# Altium project ZUMO-ROBOT.PrjPcb
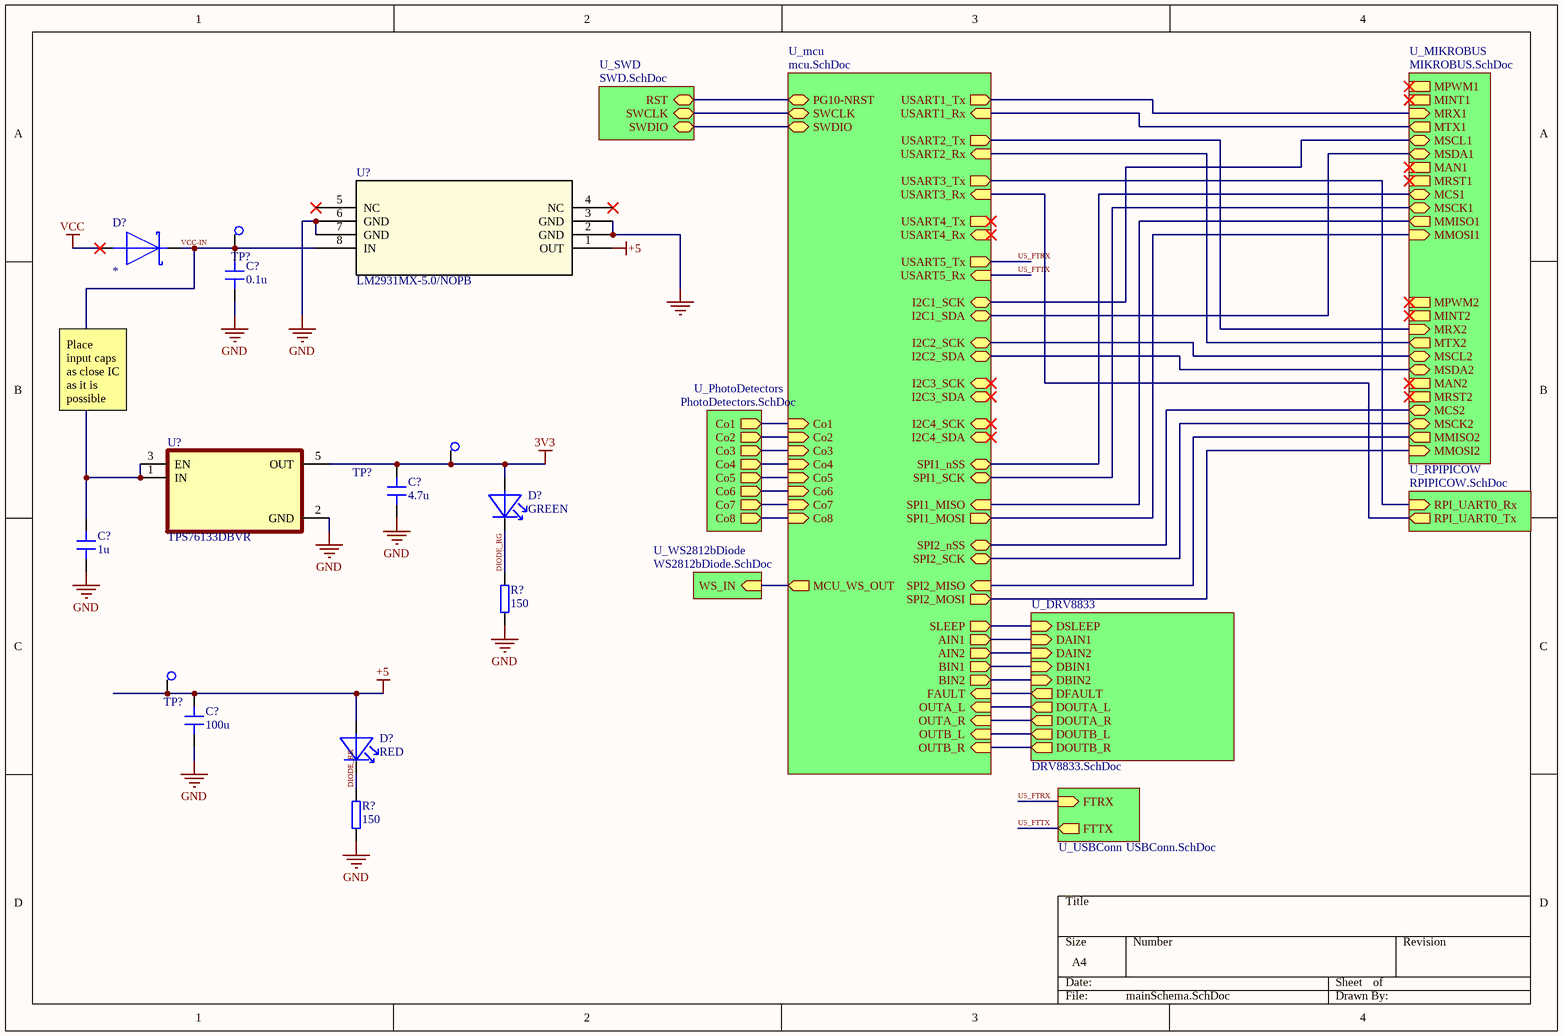
[diagram p0: mainSchema.SchDoc]
9 sheets, 118 parts. Net scope: hierarchical (ports join the sheet entries above them; power ports are global).
Sheets:
  mainSchema.SchDoc
    U_mcu = mcu.SchDoc
    U_SWD = SWD.SchDoc
    U_MIKROBUS = MIKROBUS.SchDoc
    U_PhotoDetectors = PhotoDetectors.SchDoc
    U_RPIPICOW = RPIPICOW.SchDoc
    U_DRV8833 = DRV8833.SchDoc
    U_WS2812bDiode = WS2812bDiode.SchDoc
    U_USBConn = USBConn.SchDoc

## Sheet mainSchema.SchDoc
size A4; SheetNumber: 1; SheetTotal: 9

### Parts
(Parts that share a designator on the sheet are numbered #1, #2 ... from top to bottom, then left to right.)
C?#1  0.1u
C?#2  4.7u
C?#3  1u
C?#4  100u
D?#1  *
D?#2  GREEN
D?#3  RED
R?#1  150
R?#2  150
TP?#1  *  [TestPoint]  (value not drawn)
TP?#2  *  [TestPoint]  (value not drawn)
TP?#3  *  [TestPoint]  (value not drawn)
U?#1  LM2931MX-5.0/NOPB  [M08A_TEX]
U?#2  TPS76133DBVR  [SOT95P280X145-5N]

### Sub-sheets
U_DRV8833 = DRV8833.SchDoc: DOUTB_R (out), DOUTA_R (out), DOUTB_L (out), DOUTA_L (out), DAIN1 (in), DBIN1 (in), DAIN2 (in), DBIN2 (in), DSLEEP (in), DFAULT (out)
U_mcu = mcu.SchDoc: PG10-NRST (bidir), SWCLK (bidir), SWDIO (bidir), USART1_Tx (out), USART1_Rx (in), USART2_Tx (out), USART2_Rx (in), USART3_Tx (out), USART3_Rx (in), USART4_Tx (out), USART4_Rx (in), USART5_Tx (out), USART5_Rx (in), I2C1_SCK (bidir), I2C1_SDA (bidir), I2C2_SCK (bidir), I2C2_SDA (bidir), I2C3_SCK (bidir), I2C3_SDA (bidir), I2C4_SCK (bidir), I2C4_SDA (bidir), SPI1_nSS (bidir), SPI1_SCK (bidir), SPI1_MISO (in), SPI1_MOSI (out), SPI2_nSS (bidir), SPI2_SCK (bidir), SPI2_MISO (in), SPI2_MOSI (out), Co1 (in), Co2 (in), Co3 (in), Co4 (in), Co5 (in), Co6 (in), Co7 (in), Co8 (in), AIN1 (out), AIN2 (out), BIN1 (out), BIN2 (out), FAULT (in), OUTA_L (in), OUTA_R (in), OUTB_L (in), OUTB_R (in), SLEEP (out), MCU_WS_OUT (out)
U_MIKROBUS = MIKROBUS.SchDoc: MPWM1, MINT1, MRX1 (in), MTX1 (out), MSCL1 (bidir), MSDA1 (bidir), MAN1, MRST1, MCS1 (bidir), MSCK1 (bidir), MMISO1 (out), MMOSI1 (in), MPWM2, MINT2, MRX2 (in), MTX2 (out), MSCL2 (bidir), MSDA2 (bidir), MAN2, MRST2, MCS2 (bidir), MSCK2 (bidir), MMISO2 (out), MMOSI2 (in)
U_PhotoDetectors = PhotoDetectors.SchDoc: Co1 (out), Co2 (out), Co3 (out), Co4 (out), Co5 (out), Co6 (out), Co7 (out), Co8 (out)
U_RPIPICOW = RPIPICOW.SchDoc: RPI_UART0_Tx (out), RPI_UART0_Rx (in)
U_SWD = SWD.SchDoc: SWDIO (bidir), SWCLK (bidir), RST (bidir)
U_USBConn = USBConn.SchDoc: FTRX (in), FTTX (out)
U_WS2812bDiode = WS2812bDiode.SchDoc: WS_IN (in)

### Nets
3V3: C?#2.2 D?#2.1 TP?#2.1 U?#2.5(OUT)
+5: C?#4.2 D?#3.1 TP?#3.1 U?#1.1(OUT)
GND: C?#1.1 C?#2.1 C?#3.1 C?#4.1 R?#1.1 R?#2.1 U?#1.6(GND) U?#1.7(GND) U?#2.2(GND)
NetU?#1_2: U?#1.2(GND) U?#1.3(GND)
VCC: D?#1.1
AIN1: sheet U_mcu/AIN1, sheet U_DRV8833/DAIN1
AIN2: sheet U_mcu/AIN2, sheet U_DRV8833/DAIN2
BIN1: sheet U_mcu/BIN1, sheet U_DRV8833/DBIN1
BIN2: sheet U_mcu/BIN2, sheet U_DRV8833/DBIN2
Co1: sheet U_mcu/Co1, sheet U_PhotoDetectors/Co1
Co2: sheet U_mcu/Co2, sheet U_PhotoDetectors/Co2
Co3: sheet U_mcu/Co3, sheet U_PhotoDetectors/Co3
Co4: sheet U_mcu/Co4, sheet U_PhotoDetectors/Co4
Co5: sheet U_mcu/Co5, sheet U_PhotoDetectors/Co5
Co6: sheet U_mcu/Co6, sheet U_PhotoDetectors/Co6
Co7: sheet U_mcu/Co7, sheet U_PhotoDetectors/Co7
Co8: sheet U_mcu/Co8, sheet U_PhotoDetectors/Co8
DIODE_RG: D?#2.2 R?#1.2  [project net DIODE_RG_1]
DIODE_RR: D?#3.2 R?#2.2  [project net DIODE_RR_1]
DOUTA_L: sheet U_mcu/OUTA_R, sheet U_DRV8833/DOUTA_R
DOUTB_L: sheet U_mcu/OUTB_R, sheet U_DRV8833/DOUTB_R
DOUTB_R: sheet U_mcu/OUTB_L, sheet U_DRV8833/DOUTB_L
DRV_FAULT: sheet U_mcu/FAULT, sheet U_DRV8833/DFAULT
DRV_SLEEP: sheet U_mcu/SLEEP, sheet U_DRV8833/DSLEEP
I2C1_SCK: sheet U_mcu/I2C1_SCK, sheet U_MIKROBUS/MSCL1
I2C1_SDA: sheet U_mcu/I2C1_SDA, sheet U_MIKROBUS/MSDA1
I2C2_SCK: sheet U_mcu/I2C2_SCK, sheet U_MIKROBUS/MSCL2
I2C2_SDA: sheet U_mcu/I2C2_SDA, sheet U_MIKROBUS/MSDA2
MCS1: sheet U_mcu/SPI1_nSS, sheet U_MIKROBUS/MCS1
MCS2: sheet U_mcu/SPI2_nSS, sheet U_MIKROBUS/MCS2
MCU_WS_OUT: sheet U_mcu/MCU_WS_OUT, sheet U_WS2812bDiode/WS_IN
MMISO1: sheet U_mcu/SPI1_MISO, sheet U_MIKROBUS/MMISO1
MMISO2: sheet U_mcu/SPI2_MISO, sheet U_MIKROBUS/MMISO2
MMOSI1: sheet U_mcu/SPI1_MOSI, sheet U_MIKROBUS/MMOSI1
MMOSI2: sheet U_mcu/SPI2_MOSI, sheet U_MIKROBUS/MMOSI2
MRX1: sheet U_mcu/USART1_Tx, sheet U_MIKROBUS/MRX1
MRX2: sheet U_mcu/USART2_Tx, sheet U_MIKROBUS/MRX2
MSCK1: sheet U_mcu/SPI1_SCK, sheet U_MIKROBUS/MSCK1
MSCK2: sheet U_mcu/SPI2_SCK, sheet U_MIKROBUS/MSCK2
MTX1: sheet U_mcu/USART1_Rx, sheet U_MIKROBUS/MTX1
MTX2: sheet U_mcu/USART2_Rx, sheet U_MIKROBUS/MTX2
OUTA_L: sheet U_mcu/OUTA_L, sheet U_DRV8833/DOUTA_L
PG10-NRST: sheet U_mcu/PG10-NRST, sheet U_SWD/RST
RPI_UART0_Rx: sheet U_mcu/USART3_Tx, sheet U_RPIPICOW/RPI_UART0_Rx
RPI_UART0_Tx: sheet U_mcu/USART3_Rx, sheet U_RPIPICOW/RPI_UART0_Tx
SWCLK: sheet U_mcu/SWCLK, sheet U_SWD/SWCLK
SWDIO: sheet U_mcu/SWDIO, sheet U_SWD/SWDIO
U5_FTRX: sheet U_mcu/USART5_Tx, sheet U_USBConn/FTRX  [project net FTRX]
U5_FTTX: sheet U_mcu/USART5_Rx, sheet U_USBConn/FTTX  [project net FTTX]
VCC-IN: C?#1.2 C?#3.2 D?#1.2 TP?#1.1 U?#1.8(IN) U?#2.1(IN) U?#2.3(EN)  [project net VCC-IN_1]

Not connected (* = marked no-connect by the designer): U?#1 4(NC)* 5(NC)*

### Notes on the sheet
- Place input caps as close IC as it is possible

### Library data of the parts
C?#1-C?#4 = Capacitor: Value: *; HelpURL: *; MPN: *; Supplier: *; SupplierPartNumber: *
D?#1 = Schotky: Value: *; HelpURL: *; MPN: *; Supplier: *; SupplierPartNumber: *
D?#2 D?#3 = LED: Value: *; HelpURL: *; MPN: *; Supplier: *; SupplierPartNumber: *
R?#1 R?#2 = Resistor: Value: *; HelpURL: *; MPN: *; Supplier: *; SupplierPartNumber: *
TP?#1-TP?#3 = TP: Value: *; HelpURL: *; MPN: *; Supplier: *; SupplierPartNumber: *
U?#1 = LM2931MX-5.0NOPB: No Description Available; Mfr_Name: Texas Instruments; Copyright: Copyright (C) 2023 Ultra Librarian. All rights reserved.; Manufacturer_Part_Number: LM2931MX-5.0/NOPB; RefDes: RefDes; Type: DEV
U?#2 = TPS76133DBVR: 100-mA, 16-V, low-dropout voltage regulator with reverse current protection 5-SOT-23 -40 to 125; MF: Texas Instruments; Price: None; MP: TPS76133DBVR; Mouser-Purchase-URL: https://snapeda.com/shop?store=Mouser&id=582733; SnapEDA_Link: https://www.snapeda.com/parts/TPS76133DBVR/Texas%20Instruments/view-part/582733/?ref=snap; Package: SOT-23-5 Texas Instruments; DigiKey-Purchase-URL: https://snapeda.com/shop?store=DigiKey&id=582733; Availability: Good; Texas_Instruments-Purchase-URL: https://snapeda.com/shop?store=Texas+Instruments&id=582733; Value: *

## Sheet mcu.SchDoc
size A4; SheetNumber: 2; SheetTotal: 8
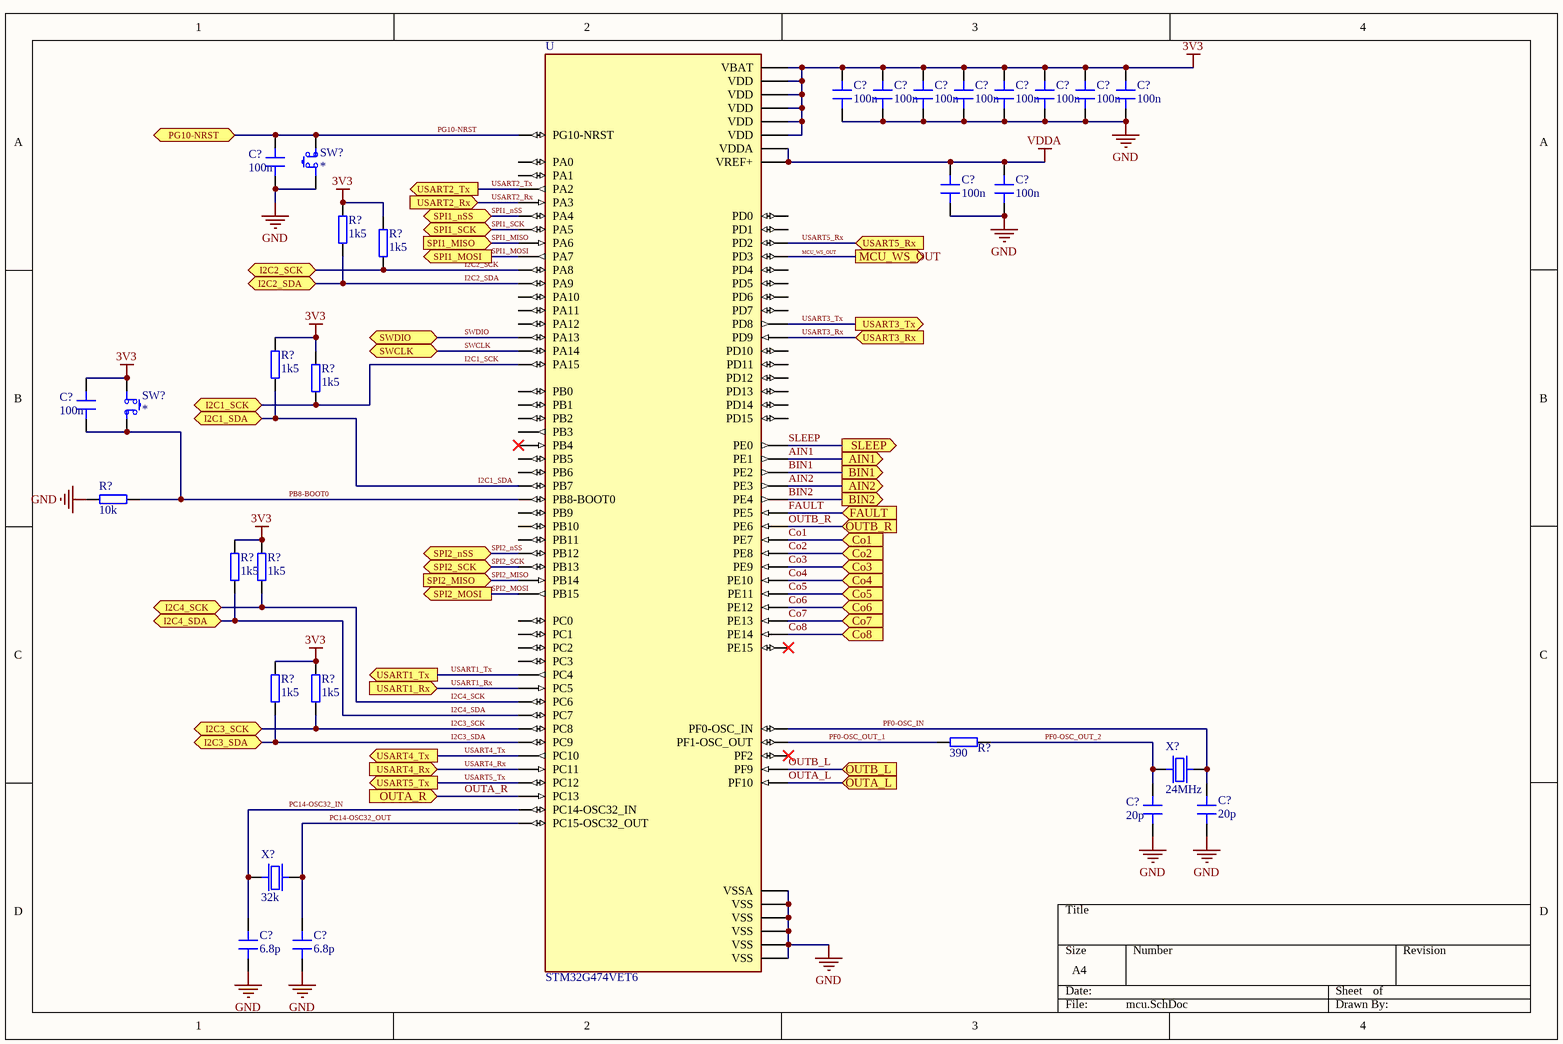
[diagram p1: mcu.SchDoc]

### Parts
(Parts that share a designator on the sheet are numbered #1, #2 ... from top to bottom, then left to right.)
C?#5  100n
C?#6  100n
C?#7  100n
C?#8  100n
C?#9  100n
C?#10  100n
C?#11  100n
C?#12  100n
C?#13  100n
C?#14  100n
C?#15  100n
C?#16  100n
C?#17  20p
C?#18  20p
C?#19  6.8p
C?#20  6.8p
R?#3  1k5
R?#4  1k5
R?#5  1k5
R?#6  1k5
R?#7  10k
R?#8  1k5
R?#9  1k5
R?#10  1k5
R?#11  1k5
R?#12  390
SW?#1  *
SW?#2  *
U  STM32G474VET6  [QFP50P1600X1600X160-100N]
X?#1  24MHz
X?#2  32k

### Ports
AIN1 (out), AIN2 (out), BIN1 (out), BIN2 (out), Co1 (in), Co2 (in), Co3 (in), Co4 (in), Co5 (in), Co6 (in), Co7 (in), Co8 (in), FAULT (in), I2C1_SCK (bidir, see mainSchema[3B]), I2C1_SDA (bidir, see mainSchema[3B]), I2C2_SCK (bidir, see mainSchema[3B]), I2C2_SDA (bidir, see mainSchema[3B]), I2C3_SCK (bidir, see mainSchema[3B]), I2C3_SDA (bidir, see mainSchema[3B]), I2C4_SCK (bidir, see mainSchema[3B]), I2C4_SDA (bidir, see mainSchema[3B]), MCU_WS_OUT (out), OUTA_L (in), OUTA_R (in), OUTB_L (in), OUTB_R (in), PG10-NRST (bidir, see mainSchema[3A]), SLEEP (out), SPI1_MISO (in, see mainSchema[3B]), SPI1_MOSI (out, see mainSchema[3C]), SPI1_nSS (bidir, see mainSchema[3B]), SPI1_SCK (bidir, see mainSchema[3B]), SPI2_MISO (in, see mainSchema[3C]), SPI2_MOSI (out, see mainSchema[3C]), SPI2_nSS (bidir, see mainSchema[3C]), SPI2_SCK (bidir, see mainSchema[3C]), SWCLK (bidir, see mainSchema[3A], SWD[2A]), SWDIO (bidir, see mainSchema[3A], SWD[2A]), USART1_Rx (in, see mainSchema[3A]), USART1_Tx (out, see mainSchema[3A]), USART2_Rx (in, see mainSchema[3A]), USART2_Tx (out, see mainSchema[3A]), USART3_Rx (in, see mainSchema[3A]), USART3_Tx (out, see mainSchema[3A]), USART4_Rx (in, see mainSchema[3A]), USART4_Tx (out, see mainSchema[3A]), USART5_Rx (in, see mainSchema[3B]), USART5_Tx (out, see mainSchema[3B])

### Nets
3V3: C?#5.2 C?#6.2 C?#7.2 C?#8.2 C?#9.2 C?#10.2 C?#11.2 C?#12.2 C?#16.1 R?#3.2 R?#4.2 R?#5.2 R?#6.2 R?#8.2 R?#9.2 R?#10.2 R?#11.2 SW?#2.1 U.6(VBAT) U.24(VDD) U.49(VDD) U.64(VDD) U.75(VDD) U.100(VDD)
GND: C?#5.1 C?#6.1 C?#7.1 C?#8.1 C?#9.1 C?#10.1 C?#11.1 C?#12.1 C?#13.2 C?#14.1 C?#15.1 C?#17.1 C?#18.1 C?#19.1 C?#20.1 R?#7.2 SW?#1.1 U.23(VSS) U.35(VSSA) U.48(VSS) U.63(VSS) U.74(VSS) U.99(VSS)
VDDA: C?#14.2 C?#15.2 U.36(VREF+) U.37(VDDA)
AIN1: U.98(PE1) ; port AIN1
AIN2: U.2(PE3) ; port AIN2
BIN1: U.1(PE2) ; port BIN1
BIN2: U.3(PE4) ; port BIN2
Co1: U.38(PE7) ; port Co1
Co2: U.39(PE8) ; port Co2
Co3: U.40(PE9) ; port Co3
Co4: U.41(PE10) ; port Co4
Co5: U.42(PE11) ; port Co5
Co6: U.43(PE12) ; port Co6
Co7: U.44(PE13) ; port Co7
Co8: U.45(PE14) ; port Co8
FAULT: U.4(PE5) ; port FAULT  [project net DRV_FAULT]
I2C1_SCK: R?#6.1 U.78(PA15) ; port I2C1_SCK
I2C1_SDA: R?#5.1 U.94(PB7) ; port I2C1_SDA
I2C2_SCK: R?#4.1 U.69(PA8) ; port I2C2_SCK
I2C2_SDA: R?#3.1 U.70(PA9) ; port I2C2_SDA
I2C3_SCK: R?#11.1 U.67(PC8) ; port I2C3_SCK
I2C3_SDA: R?#10.1 U.68(PC9) ; port I2C3_SDA
I2C4_SCK: R?#9.1 U.65(PC6) ; port I2C4_SCK
I2C4_SDA: R?#8.1 U.66(PC7) ; port I2C4_SDA
MCU_WS_OUT: U.85(PD3) ; port MCU_WS_OUT
OUTA_L: U.11(PF10) ; port OUTA_L
OUTA_R: U.7(PC13) ; port OUTA_R  [project net DOUTA_L]
OUTB_L: U.10(PF9) ; port OUTB_L  [project net DOUTB_R]
OUTB_R: U.5(PE6) ; port OUTB_R  [project net DOUTB_L]
PB8-BOOT0: C?#16.2 R?#7.1 SW?#2.2 U.95(PB8-BOOT0)  [project net PB8-BOOT0_2]
PC14-OSC32_IN: C?#19.2 U.8(PC14-OSC32_IN) X?#2.1  [project net PC14-OSC32_IN_2]
PC14-OSC32_OUT: C?#20.2 U.9(PC15-OSC32_OUT) X?#2.2  [project net PC14-OSC32_OUT_2]
PF0-OSC_IN: C?#18.2 U.12(PF0-OSC_IN) X?#1.2  [project net PF0-OSC_IN_2]
PF0-OSC_OUT_1: R?#12.1 U.13(PF1-OSC_OUT)  [project net PF0-OSC_OUT_1_2]
PF0-OSC_OUT_2: C?#17.2 R?#12.2 X?#1.1  [project net PF0-OSC_OUT_2_2]
PG10-NRST: C?#13.1 SW?#1.2 U.14(PG10-NRST) ; port PG10-NRST
SLEEP: U.97(PE0) ; port SLEEP  [project net DRV_SLEEP]
SPI1_MISO: U.28(PA6) ; port SPI1_MISO  [project net MMISO1]
SPI1_MOSI: U.29(PA7) ; port SPI1_MOSI  [project net MMOSI1]
SPI1_nSS: U.26(PA4) ; port SPI1_nSS  [project net MCS1]
SPI1_SCK: U.27(PA5) ; port SPI1_SCK  [project net MSCK1]
SPI2_MISO: U.53(PB14) ; port SPI2_MISO  [project net MMISO2]
SPI2_MOSI: U.54(PB15) ; port SPI2_MOSI  [project net MMOSI2]
SPI2_nSS: U.51(PB12) ; port SPI2_nSS  [project net MCS2]
SPI2_SCK: U.52(PB13) ; port SPI2_SCK  [project net MSCK2]
SWCLK: U.77(PA14) ; port SWCLK
SWDIO: U.76(PA13) ; port SWDIO
USART1_Rx: U.31(PC5) ; port USART1_Rx  [project net MTX1]
USART1_Tx: U.30(PC4) ; port USART1_Tx  [project net MRX1]
USART2_Rx: U.25(PA3) ; port USART2_Rx  [project net MTX2]
USART2_Tx: U.22(PA2) ; port USART2_Tx  [project net MRX2]
USART3_Rx: U.56(PD9) ; port USART3_Rx  [project net RPI_UART0_Tx]
USART3_Tx: U.55(PD8) ; port USART3_Tx  [project net RPI_UART0_Rx]
USART4_Rx: U.80(PC11) ; port USART4_Rx
USART4_Tx: U.79(PC10) ; port USART4_Tx
USART5_Rx: U.84(PD2) ; port USART5_Rx  [project net FTTX]
USART5_Tx: U.81(PC12) ; port USART5_Tx  [project net FTRX]

Not connected (* = marked no-connect by the designer): U 15(PC0) 16(PC1) 17(PC2) 18(PC3) 19(PF2)* 20(PA0) 21(PA1) 32(PB0) 33(PB1) 34(PB2) 46(PE15)* 47(PB10) 50(PB11) 57(PD10) 58(PD11) 59(PD12) 60(PD13) 61(PD14) 62(PD15) 71(PA10) 72(PA11) 73(PA12) 82(PD0) 83(PD1) 86(PD4) 87(PD5) 88(PD6) 89(PD7) 90(PB3) 91(PB4)* 92(PB5) 93(PB6) 96(PB9)

### Notes on the sheet
- (near C?#7) 100nF for each VDD pin
- (near R?#7) Main Flash memory is selected as boot area when GND. When 3V3 Embedded SRAM1 isselected as boot area

### Library data of the parts
C?#5-C?#20 = Capacitor: Value: *; HelpURL: *; MPN: *; Supplier: *; SupplierPartNumber: *
R?#3-R?#12 = Resistor: Value: *; HelpURL: *; MPN: *; Supplier: *; SupplierPartNumber: *
SW?#1 SW?#2 = Switch: Value: *; HelpURL: *; MPN: *; Supplier: *; SupplierPartNumber: *
U = STM32G474VET6: ARMÂ® CortexÂ®-M4F STM32G4 Microcontroller IC 32-Bit 170MHz 512KB _512K x 8_ FLASH 100-LQFP _14x14_; MF: STMicroelectronics; MP: STM32G474VET6; Value: *; Package: LQFP-100 STMicroelectronics; Availability: Unavailable; Price: None; SnapEDA_Link: https://www.snapeda.com/parts/STM32G474VET6/STMicroelectronics/view-part/3664237/?ref=snap
X?#1 X?#2 = Crystal: Value: *; HelpURL: *; MPN: *; Supplier: *; SupplierPartNumber: *

## Sheet SWD.SchDoc
size A4; SheetNumber: 4; SheetTotal: 4
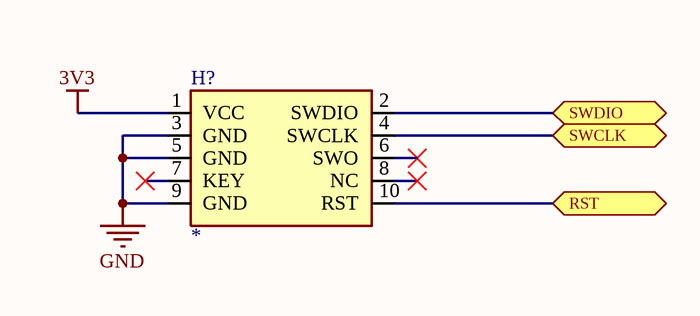
[diagram p2: SWD.SchDoc]

### Parts
(Parts that share a designator on the sheet are numbered #1, #2 ... from top to bottom, then left to right.)
H?#1  *  [SOP10]

### Ports
RST (bidir, see mainSchema[2B]), SWCLK (bidir, see mainSchema[2B], mcu[1B]), SWDIO (bidir, see mainSchema[2B], mcu[1B])

### Nets
3V3: H?#1.1(VCC)
GND: H?#1.3(GND) H?#1.5(GND) H?#1.9(GND)
PG10-NRST: H?#1.10(RST) ; port RST
SWCLK: H?#1.4(SWCLK) ; port SWCLK
SWDIO: H?#1.2(SWDIO) ; port SWDIO

Not connected (* = marked no-connect by the designer): H?#1 6(SWO)* 7(KEY)* 8(NC)*

### Library data of the parts
H?#1 = SWD_HEADER: Value: *; HelpURL: *; MPN: *; Supplier: *; SupplierPartNumber: *

## Sheet MIKROBUS.SchDoc
size A4; SheetNumber: 5; SheetTotal: 6
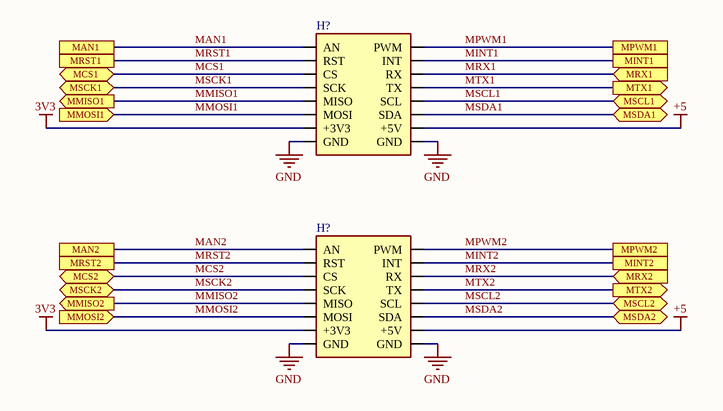
[diagram p3: MIKROBUS.SchDoc]

### Parts
(Parts that share a designator on the sheet are numbered #1, #2 ... from top to bottom, then left to right.)
H?#2  *  (value not drawn)
H?#3  *  (value not drawn)

### Ports
MAN1 (see mainSchema[3A]), MAN2 (see mainSchema[3B]), MCS1 (bidir, see mainSchema[3A]), MCS2 (bidir, see mainSchema[3B]), MINT1 (see mainSchema[3A]), MINT2 (see mainSchema[3B]), MMISO1 (out, see mainSchema[3A]), MMISO2 (out, see mainSchema[3B]), MMOSI1 (in, see mainSchema[3A]), MMOSI2 (in, see mainSchema[3B]), MPWM1 (see mainSchema[3A]), MPWM2 (see mainSchema[3B]), MRST1 (see mainSchema[3A]), MRST2 (see mainSchema[3B]), MRX1 (in, see mainSchema[3A]), MRX2 (in, see mainSchema[3B]), MSCK1 (bidir, see mainSchema[3A]), MSCK2 (bidir, see mainSchema[3B]), MSCL1 (bidir, see mainSchema[3A]), MSCL2 (bidir, see mainSchema[3B]), MSDA1 (bidir, see mainSchema[3A]), MSDA2 (bidir, see mainSchema[3B]), MTX1 (out, see mainSchema[3A]), MTX2 (out, see mainSchema[3B])

### Nets
3V3: H?#2.15(+3V3) H?#3.15(+3V3)
+5: H?#2.2(+5V) H?#3.2(+5V)
GND: H?#2.1(GND) H?#2.16(GND) H?#3.1(GND) H?#3.16(GND)
MAN1: H?#2.9(AN) ; port MAN1
MAN2: H?#3.9(AN) ; port MAN2
MCS1: H?#2.11(CS) ; port MCS1
MCS2: H?#3.11(CS) ; port MCS2
MINT1: H?#2.7(INT) ; port MINT1
MINT2: H?#3.7(INT) ; port MINT2
MMISO1: H?#2.13(MISO) ; port MMISO1
MMISO2: H?#3.13(MISO) ; port MMISO2
MMOSI1: H?#2.14(MOSI) ; port MMOSI1
MMOSI2: H?#3.14(MOSI) ; port MMOSI2
MPWM1: H?#2.8(PWM) ; port MPWM1
MPWM2: H?#3.8(PWM) ; port MPWM2
MRST1: H?#2.10(RST) ; port MRST1
MRST2: H?#3.10(RST) ; port MRST2
MRX1: H?#2.6(RX) ; port MRX1
MRX2: H?#3.6(RX) ; port MRX2
MSCK1: H?#2.12(SCK) ; port MSCK1
MSCK2: H?#3.12(SCK) ; port MSCK2
MSCL1: H?#2.4(SCL) ; port MSCL1  [project net I2C1_SCK]
MSCL2: H?#3.4(SCL) ; port MSCL2  [project net I2C2_SCK]
MSDA1: H?#2.3(SDA) ; port MSDA1  [project net I2C1_SDA]
MSDA2: H?#3.3(SDA) ; port MSDA2  [project net I2C2_SDA]
MTX1: H?#2.5(TX) ; port MTX1
MTX2: H?#3.5(TX) ; port MTX2

### Library data of the parts
H?#2 H?#3 = MIKROBUS: Value: *; HelpURL: *; MPN: *; Supplier: *; SupplierPartNumber: *

## Sheet PhotoDetectors.SchDoc
size A4; SheetNumber: 6; SheetTotal: 7
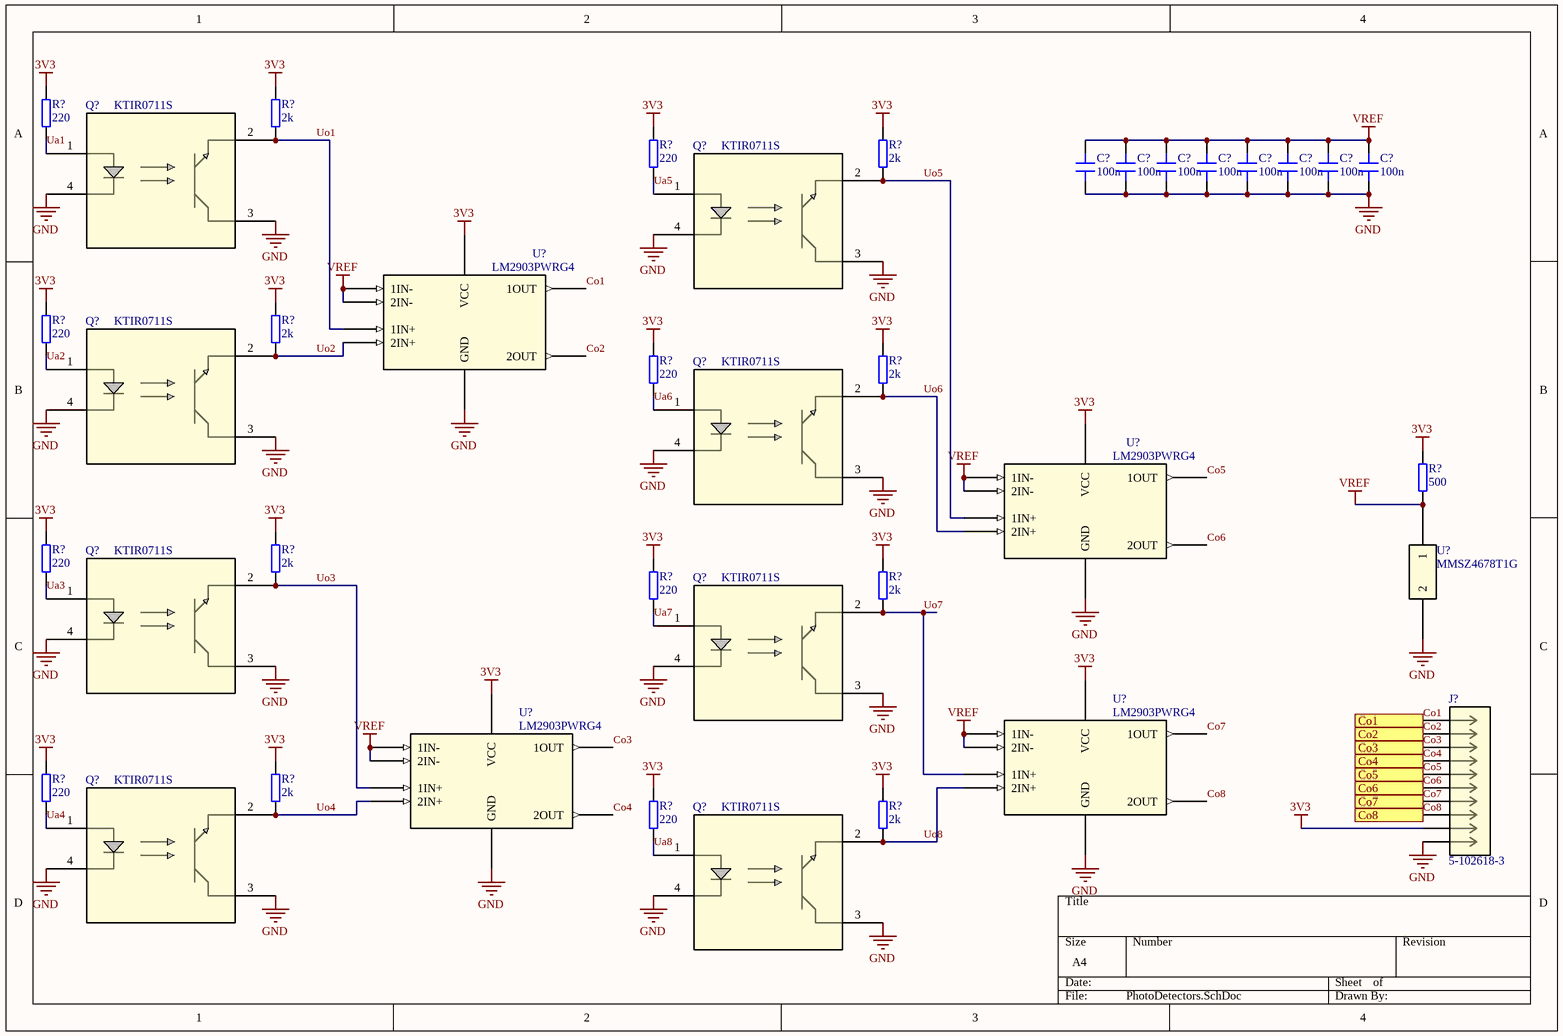
[diagram p4: PhotoDetectors.SchDoc]

### Parts
(Parts that share a designator on the sheet are numbered #1, #2 ... from top to bottom, then left to right.)
C?#21  100n
C?#22  100n
C?#23  100n
C?#24  100n
C?#25  100n
C?#26  100n
C?#27  100n
C?#28  100n
J?#1  5-102618-3  [CONN_102618-3_TEC]
Q?#1  KTIR0711S  [KTIR0711S_KNB]
Q?#2  KTIR0711S  [KTIR0711S_KNB]
Q?#3  KTIR0711S  [KTIR0711S_KNB]
Q?#4  KTIR0711S  [KTIR0711S_KNB]
Q?#5  KTIR0711S  [KTIR0711S_KNB]
Q?#6  KTIR0711S  [KTIR0711S_KNB]
Q?#7  KTIR0711S  [KTIR0711S_KNB]
Q?#8  KTIR0711S  [KTIR0711S_KNB]
R?#13  220
R?#14  2k
R?#15  220
R?#16  2k
R?#17  220
R?#18  2k
R?#19  220
R?#20  2k
R?#21  500
R?#22  220
R?#23  2k
R?#24  220
R?#25  2k
R?#26  220
R?#27  2k
R?#28  220
R?#29  2k
U?#3  LM2903PWRG4  [PW8]
U?#4  MMSZ4678T1G  [SOD_8T1G_ONS]
U?#5  LM2903PWRG4  [PW8]
U?#6  LM2903PWRG4  [PW8]
U?#7  LM2903PWRG4  [PW8]

### Ports
Co1 (out), Co2 (out), Co3 (out), Co4 (out), Co5 (out), Co6 (out), Co7 (out), Co8 (out)

### Nets
3V3: J?#1.9 R?#13.2 R?#14.2 R?#15.2 R?#16.2 R?#17.2 R?#18.2 R?#19.2 R?#20.2 R?#21.2 R?#22.2 R?#23.2 R?#24.2 R?#25.2 R?#26.2 R?#27.2 R?#28.2 R?#29.2 U?#3.8(VCC) U?#5.8(VCC) U?#6.8(VCC) U?#7.8(VCC)
GND: C?#21.1 C?#22.1 C?#23.1 C?#24.1 C?#25.1 C?#26.1 C?#27.1 C?#28.1 J?#1.10 Q?#1.3 Q?#1.4 Q?#2.3 Q?#2.4 Q?#3.3 Q?#3.4 Q?#4.3 Q?#4.4 Q?#5.3 Q?#5.4 Q?#6.3 Q?#6.4 Q?#7.3 Q?#7.4 Q?#8.3 Q?#8.4 U?#3.4(GND) U?#4.2 U?#5.4(GND) U?#6.4(GND) U?#7.4(GND)
VREF: C?#21.2 C?#22.2 C?#23.2 C?#24.2 C?#25.2 C?#26.2 C?#27.2 C?#28.2 R?#21.1 U?#3.2(1IN-) U?#3.6(2IN-) U?#4.1 U?#5.2(1IN-) U?#5.6(2IN-) U?#6.2(1IN-) U?#6.6(2IN-) U?#7.2(1IN-) U?#7.6(2IN-)
Co1: J?#1.1 U?#3.1(1OUT) ; port Co1
Co2: J?#1.2 U?#3.7(2OUT) ; port Co2
Co3: J?#1.3 U?#7.1(1OUT) ; port Co3
Co4: J?#1.4 U?#7.7(2OUT) ; port Co4
Co5: J?#1.5 U?#5.1(1OUT) ; port Co5
Co6: J?#1.6 U?#5.7(2OUT) ; port Co6
Co7: J?#1.7 U?#6.1(1OUT) ; port Co7
Co8: J?#1.8 U?#6.7(2OUT) ; port Co8
Ua1: Q?#1.1 R?#13.1  [project net Ua1_6]
Ua2: Q?#3.1 R?#17.1  [project net Ua2_6]
Ua3: Q?#5.1 R?#22.1  [project net Ua3_6]
Ua4: Q?#7.1 R?#26.1  [project net Ua4_6]
Ua5: Q?#2.1 R?#15.1  [project net Ua5_6]
Ua6: Q?#4.1 R?#19.1  [project net Ua6_6]
Ua7: Q?#6.1 R?#24.1  [project net Ua7_6]
Ua8: Q?#8.1 R?#28.1  [project net Ua8_6]
Uo1: Q?#1.2 R?#14.1 U?#3.3(1IN+)  [project net Uo1_6]
Uo2: Q?#3.2 R?#18.1 U?#3.5(2IN+)  [project net Uo2_6]
Uo3: Q?#5.2 R?#23.1 U?#7.3(1IN+)  [project net Uo3_6]
Uo4: Q?#7.2 R?#27.1 U?#7.5(2IN+)  [project net Uo4_6]
Uo5: Q?#2.2 R?#16.1 U?#5.3(1IN+)  [project net Uo5_6]
Uo6: Q?#4.2 R?#20.1 U?#5.5(2IN+)  [project net Uo6_6]
Uo7: Q?#6.2 R?#25.1 U?#6.3(1IN+)  [project net Uo7_6]
Uo8: Q?#8.2 R?#29.1 U?#6.5(2IN+)  [project net Uo8_6]

### Library data of the parts
C?#21-C?#28 = Capacitor: Value: *; HelpURL: *; MPN: *; Supplier: *; SupplierPartNumber: *
J?#1 = 5-102618-3: No Description Available; Mfr_Name: TE Connectivity; Type: DEV; Copyright: Copyright (C) 2023 Ultra Librarian. All rights reserved.; Manufacturer_Part_Number: 5-102618-3; RefDes: RefDes
Q?#1-Q?#8 = KTIR0711S: No Description Available; Mfr_Name: Kingbright; Type: DEV; Copyright: Copyright (C) 2023 Ultra Librarian. All rights reserved.; Manufacturer_Part_Number: KTIR0711S; RefDes: RefDes
R?#13-R?#29 = Resistor: Value: *; HelpURL: *; MPN: *; Supplier: *; SupplierPartNumber: *
U?#3 U?#5-U?#7 = LM2903PWRG4: No Description Available; Mfr_Name: Texas Instruments; Copyright: Copyright (C) 2023 Ultra Librarian. All rights reserved.; Manufacturer_Part_Number: LM2903PWRG4; RefDes: RefDes; Type: DEV
U?#4 = MMSZ4678T1G: No Description Available; Mfr_Name: onsemi; Copyright: Copyright (C) 2023 Ultra Librarian. All rights reserved.; Manufacturer_Part_Number: MMSZ4678T1G; RefDes: RefDes; Type: DEV

## Sheet RPIPICOW.SchDoc
size A4; SheetNumber: 5; SheetTotal: 8
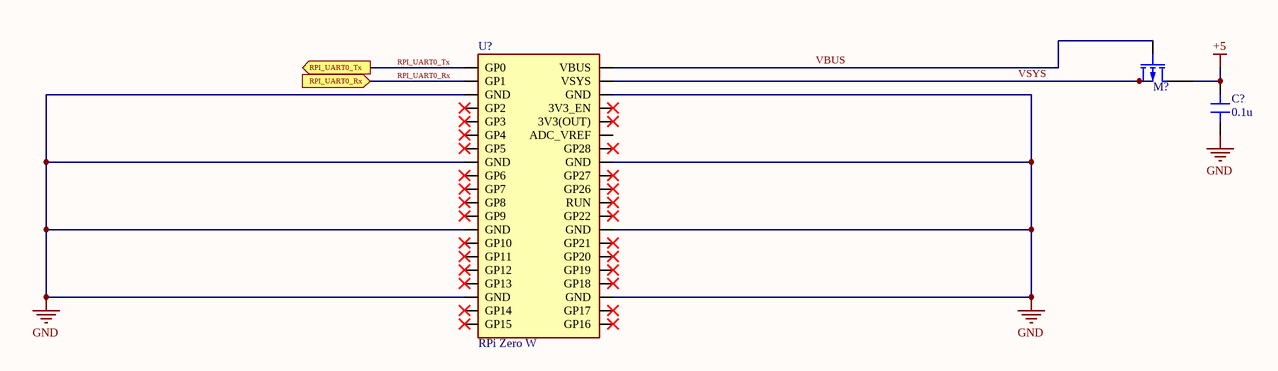
[diagram p5: RPIPICOW.SchDoc]

### Parts
(Parts that share a designator on the sheet are numbered #1, #2 ... from top to bottom, then left to right.)
C?#29  0.1u
M?  P-channel MOS1 MOSFET Shichman and Hodges Model  (value not drawn)
U?#8  RPi Zero W  [PICO_W]

### Ports
RPI_UART0_Rx (in), RPI_UART0_Tx (out)

### Nets
+5: C?#29.2 M?.1(D)
GND: C?#29.1 U?#8.3(GND) U?#8.8(GND) U?#8.13(GND) U?#8.18(GND) U?#8.23(GND) U?#8.28(GND) U?#8.33(GND) U?#8.38(GND)
RPI_UART0_Rx: U?#8.22(GP1) ; port RPI_UART0_Rx
RPI_UART0_Tx: U?#8.21(GP0) ; port RPI_UART0_Tx
VBUS: M?.2(G) U?#8.20(VBUS)  [project net VBUS_5]
VSYS: M?.3(S) M?.4(B) U?#8.19(VSYS)  [project net VSYS_5]

Not connected (* = marked no-connect by the designer): U?#8 1(GP16)* 2(GP17)* 4(GP18)* 5(GP19)* 6(GP20)* 7(GP21)* 9(GP22)* 10(RUN)* 11(GP26)* 12(GP27)* 14(GP28)* 15(ADC_VREF) 16(3V3(OUT))* 17(3V3_EN)* 24(GP2)* 25(GP3)* 26(GP4)* 27(GP5)* 29(GP6)* 30(GP7)* 31(GP8)* 32(GP9)* 34(GP10)* 35(GP11)* 36(GP12)* 37(GP13)* 39(GP14)* 40(GP15)*

### Library data of the parts
C?#29 = Capacitor: Value: *; HelpURL: *; MPN: *; Supplier: *; SupplierPartNumber: *
M? = MOSFET P-ch Lev1: CBD: 0; FC: 0.5; IS: 1e-14; KP: 2e-05; PB: 0.8; PHI: 0.6; TNOM: 27; SimulationGenericComponent: True; CBS: 0; CGBO: 0; CGDO: 0; CGSO: 0; CJ: 0; CJSW: 0; GAMMA: 0; JS: 0; LAMBDA: 0; LD: 0; MJ: 0.5; MJSW: 0.5; NSS: 0; NSUB: 0; RD: 0; RS: 0; RSH: 0; TOX: 0; TPG: 0; U0: 0; VTO: 0
U?#8 = PICO_W: Value: *; HelpURL: *; MPN: *; Supplier: *; SupplierPartNumber: *

## Sheet DRV8833.SchDoc
size A4; SheetNumber: 7; SheetTotal: 7
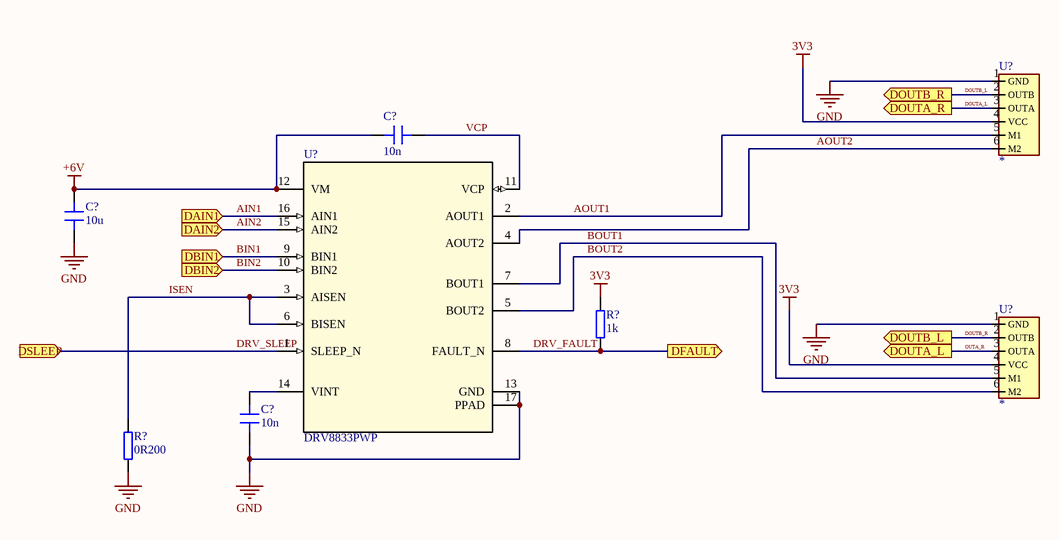
[diagram p6: DRV8833.SchDoc]

### Parts
(Parts that share a designator on the sheet are numbered #1, #2 ... from top to bottom, then left to right.)
C?#30  10n
C?#31  10u
C?#32  10n
R?#30  1k
R?#31  0R200
U?#9  *  [HEADER6]
U?#10  DRV8833PWP  [PWP0016C_N]
U?#11  *  [HEADER6]

### Ports
DAIN1 (in), DAIN2 (in), DBIN1 (in), DBIN2 (in), DFAULT (out), DOUTA_L (out), DOUTA_R (out), DOUTB_L (out), DOUTB_R (out), DSLEEP (in)

### Nets
3V3: R?#30.1 U?#9.4(VCC) U?#11.4(VCC)
+6V: C?#30.1 C?#31.2 U?#10.12(VM)
GND: C?#31.1 C?#32.1 R?#31.1 U?#9.1(GND) U?#10.13(GND) U?#10.17(PPAD) U?#11.1(GND)
AIN1: U?#10.16(AIN1) ; port DAIN1
AIN2: U?#10.15(AIN2) ; port DAIN2
AOUT1: U?#9.5(M1) U?#10.2(AOUT1)  [project net AOUT1_7]
AOUT2: U?#9.6(M2) U?#10.4(AOUT2)  [project net AOUT2_7]
BIN1: U?#10.9(BIN1) ; port DBIN1
BIN2: U?#10.10(BIN2) ; port DBIN2
BOUT1: U?#10.7(BOUT1) U?#11.5(M1)  [project net BOUT1_7]
BOUT2: U?#10.5(BOUT2) U?#11.6(M2)  [project net BOUT2_7]
DOUTA_L: U?#9.3(OUTA) ; port DOUTA_R
DOUTB_L: U?#9.2(OUTB) ; port DOUTB_R
DOUTB_R: U?#11.2(OUTB) ; port DOUTB_L
DRV_FAULT: R?#30.2 U?#10.8(FAULT_N) ; port DFAULT
DRV_SLEEP: U?#10.1(SLEEP_N) ; port DSLEEP
ISEN: R?#31.2 U?#10.3(AISEN) U?#10.6(BISEN)  [project net ISEN_7]
OUTA_R: U?#11.3(OUTA) ; port DOUTA_L  [project net OUTA_L]
VCP: C?#30.2 U?#10.11(VCP)  [project net VCP_7]
NetC?#32_2: C?#32.2 U?#10.14(VINT)

### Library data of the parts
C?#30-C?#32 = Capacitor: Value: *; HelpURL: *; MPN: *; Supplier: *; SupplierPartNumber: *
R?#30 R?#31 = Resistor: Value: *; HelpURL: *; MPN: *; Supplier: *; SupplierPartNumber: *
U?#9 U?#11 = 6PINH: Value: *; HelpURL: *; MPN: *; Supplier: *; SupplierPartNumber: *
U?#10 = DRV8833PWP: No Description Available; Mfr_Name: Texas Instruments; Type: DEV; RefDes: RefDes; Copyright: Copyright (C) 2023 Ultra Librarian. All rights reserved.; Manufacturer_Part_Number: DRV8833PWP

## Sheet WS2812bDiode.SchDoc
size A4; SheetNumber: 8; SheetTotal: 8
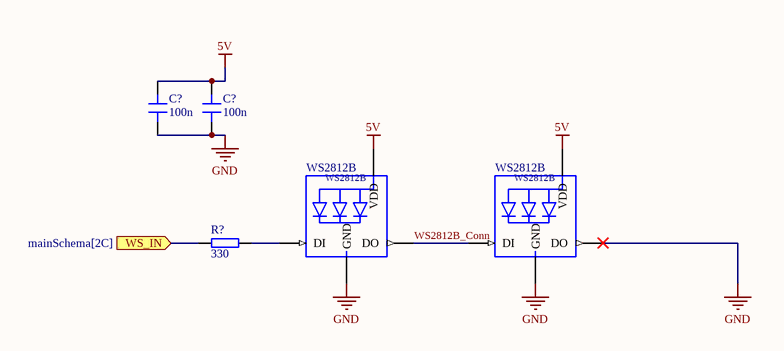
[diagram p7: WS2812bDiode.SchDoc]

### Parts
(Parts that share a designator on the sheet are numbered #1, #2 ... from top to bottom, then left to right.)
C?#33  100n
C?#34  100n
LED  WS2812B  [WS2812B]
LED?  WS2812B  [WS2812B]
R?#32  330

### Ports
WS_IN (in, see mainSchema[2C])

### Nets
5V: C?#33.2 C?#34.2 LED.1-VDD(VDD) LED?.1-VDD(VDD)
GND: C?#33.1 C?#34.1 LED.3-GND(GND) LED?.2-DOUT(DO) LED?.3-GND(GND)
MCU_WS_OUT: R?#32.1 ; port WS_IN
WS2812B_Conn: LED.2-DOUT(DO) LED?.4-DIN(DI)  [project net WS2812B_Conn_8]
NetLED_4-DIN: LED.4-DIN(DI) R?#32.2

### Library data of the parts
C?#33 C?#34 = Capacitor: Value: *; HelpURL: *; MPN: *; Supplier: *; SupplierPartNumber: *
LED LED? = WS2812B: Raspberry Pi HAT _40 pin_ Wheeled Robotics Kit; MF: SparkFun Electronics; Availability: Unavailable; SnapEDA_Link: https://www.snapeda.com/parts/WS2812B/Worldsemi/view-part/1038297/?ref=snap; MP: WS2812B; Price: None; Value: *; Package: None
R?#32 = Resistor: Value: *; HelpURL: *; MPN: *; Supplier: *; SupplierPartNumber: *

## Sheet USBConn.SchDoc
size A4; SheetNumber: 9; SheetTotal: 9
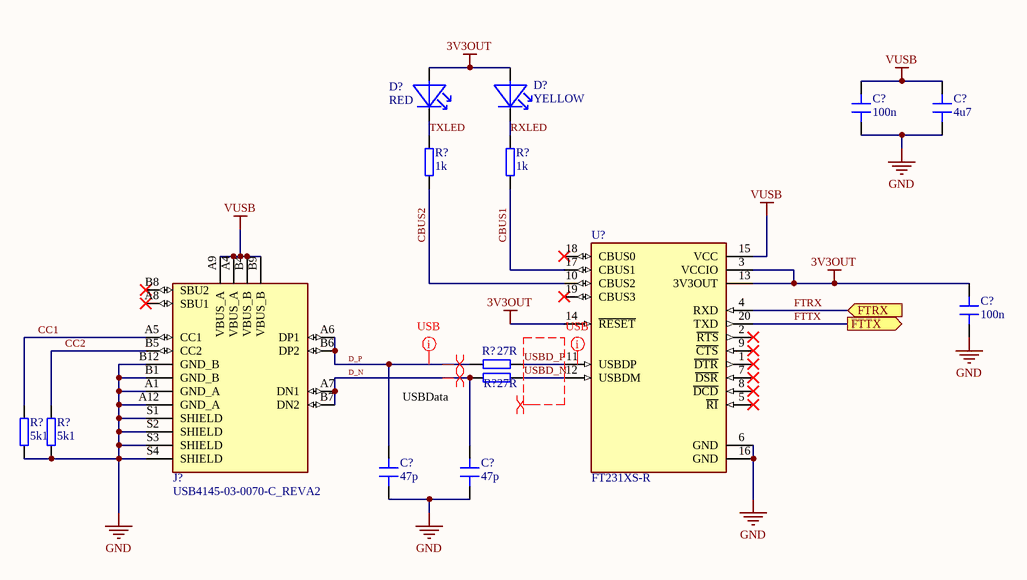
[diagram p8: USBConn.SchDoc]

### Parts
(Parts that share a designator on the sheet are numbered #1, #2 ... from top to bottom, then left to right.)
C?#35  100n
C?#36  4u7
C?#37  100n
C?#38  47p
C?#39  47p
D?#4  RED
D?#5  YELLOW
J?#2  USB4145-03-0070-C_REVA2  [GCT_USB4145-03-0070-C_REVA2]
R?#33  1k
R?#34  1k
R?#35  27R
R?#36  27R
R?#37  5k1
R?#38  5k1
U?#12  FT231XS-R  [SOP63P599X175-20N]

### Ports
FTRX (in), FTTX (out)

### Nets
3V3OUT: C?#37.2 D?#4.1 D?#5.1 U?#12.3(VCCIO) U?#12.13(3V3OUT) U?#12.14(~{RESET})
GND: C?#35.1 C?#36.1 C?#37.1 C?#38.1 C?#39.1 J?#2.A1(GND_A) J?#2.A12(GND_A) J?#2.B1(GND_B) J?#2.B12(GND_B) J?#2.S1(SHIELD) J?#2.S2(SHIELD) J?#2.S3(SHIELD) J?#2.S4(SHIELD) R?#37.1 R?#38.1 U?#12.6(GND) U?#12.16(GND)
VUSB: C?#35.2 C?#36.2 J?#2.A4(VBUS_A) J?#2.A9(VBUS_A) J?#2.B4(VBUS_B) J?#2.B9(VBUS_B) U?#12.15(VCC)
CBUS1: R?#34.1 U?#12.17(CBUS1)  [project net CBUS1_9]
CBUS2: R?#33.1 U?#12.10(CBUS2)  [project net CBUS2_9]
CC1: J?#2.A5(CC1) R?#37.2  [project net CC1_9]
CC2: J?#2.B5(CC2) R?#38.2  [project net CC2_9]
D_N: C?#39.2 J?#2.A7(DN1) J?#2.B7(DN2) R?#36.1  [project net D_N_9]
D_P: C?#38.2 J?#2.A6(DP1) J?#2.B6(DP2) R?#35.1  [project net D_P_9]
FTRX: U?#12.4(RXD) ; port FTRX
FTTX: U?#12.20(TXD) ; port FTTX
RXLED: D?#5.2 R?#34.2  [project net RXLED_9]
TXLED: D?#4.2 R?#33.2  [project net TXLED_9]
USBD_N: R?#36.2 U?#12.12(USBDM)  [project net USBD_N_9]
USBD_P: R?#35.2 U?#12.11(USBDP)  [project net USBD_P_9]

Not connected (* = marked no-connect by the designer): J?#2 A8(SBU1)* B8(SBU2)*; U?#12 1(~{DTR})* 2(~{RTS})* 5(~{RI})* 7(~{DSR})* 8(~{DCD})* 9(~{CTS})* 18(CBUS0)* 19(CBUS3)*

### Layout directives
differential pair: D_N_9, D_P_9, USBD_N, USBD_P
mark named USB: (no net found under the mark), D_P_9

### Notes on the sheet
- (near R?#36) USBData

### Library data of the parts
C?#35-C?#39 = Capacitor: Value: *; HelpURL: *; MPN: *; Supplier: *; SupplierPartNumber: *
D?#4 D?#5 = LED: Value: *; HelpURL: *; MPN: *; Supplier: *; SupplierPartNumber: *
J?#2 = USB4145-03-0070-C_REVA2: Type C USB 2.0 Connector; MF: Global Connector Technology; Availability: In Stock; Value: *; Check_prices: https://www.snapeda.com/parts/USB4145-03-0070-C/Global+Connector+Technology/view-part/?ref=eda; Package: None; Price: None; MP: USB4145-03-0070-C; SnapEDA_Link: https://www.snapeda.com/parts/USB4145-03-0070-C/Global+Connector+Technology/view-part/?ref=snap; Purchase-URL: https://pricing.snapeda.com/search/part/USB4145-03-0070-C/?ref=eda
R?#33-R?#38 = Resistor: Value: *; HelpURL: *; MPN: *; Supplier: *; SupplierPartNumber: *
U?#12 = FT231XS-R: USB Bridge, USB to UART USB 2.0 UART Interface 20-SSOP; MF: FTDI,; Package: SSOP-20 FTDI; Price: None; Check_prices: https://www.snapeda.com/parts/FT231XS-R/FTDI%252C+Future+Technology+Devices+International+Ltd/view-part/?ref=eda; Value: *; SnapEDA_Link: https://www.snapeda.com/parts/FT231XS-R/FTDI%252C+Future+Technology+Devices+International+Ltd/view-part/?ref=snap; MP: FT231XS-R; Availability: In Stock; Purchase-URL: https://pricing.snapeda.com/search?q=FT231XS-R&ref=eda

## Nets that join several sheets
3V3: mainSchema (C?#2.2 D?#2.1 TP?#2.1 U?#2.5), mcu (24 pins), SWD (H?#1.1), MIKROBUS (H?#2.15 H?#3.15), PhotoDetectors (22 pins), DRV8833 (R?#30.1 U?#9.4 U?#11.4)
+5: mainSchema (C?#4.2 D?#3.1 TP?#3.1 U?#1.1), MIKROBUS (H?#2.2 H?#3.2), RPIPICOW (C?#29.2 M?.1)
GND: mainSchema (9 pins), mcu (23 pins), SWD (H?#1.3 H?#1.5 H?#1.9), MIKROBUS (H?#2.1 H?#2.16 H?#3.1 H?#3.16), PhotoDetectors (30 pins), RPIPICOW (9 pins), DRV8833 (7 pins), WS2812bDiode (5 pins), USBConn (17 pins)
AIN1: mcu (U.98), DRV8833 (U?#10.16)
AIN2: mcu (U.2), DRV8833 (U?#10.15)
BIN1: mcu (U.1), DRV8833 (U?#10.9)
BIN2: mcu (U.3), DRV8833 (U?#10.10)
Co1: mcu (U.38), PhotoDetectors (J?#1.1 U?#3.1)
Co2: mcu (U.39), PhotoDetectors (J?#1.2 U?#3.7)
Co3: mcu (U.40), PhotoDetectors (J?#1.3 U?#7.1)
Co4: mcu (U.41), PhotoDetectors (J?#1.4 U?#7.7)
Co5: mcu (U.42), PhotoDetectors (J?#1.5 U?#5.1)
Co6: mcu (U.43), PhotoDetectors (J?#1.6 U?#5.7)
Co7: mcu (U.44), PhotoDetectors (J?#1.7 U?#6.1)
Co8: mcu (U.45), PhotoDetectors (J?#1.8 U?#6.7)
DOUTA_L: mcu (U.7), DRV8833 (U?#9.3)
DOUTB_L: mcu (U.5), DRV8833 (U?#9.2)
DOUTB_R: mcu (U.10), DRV8833 (U?#11.2)
DRV_FAULT: mcu (U.4), DRV8833 (R?#30.2 U?#10.8)
DRV_SLEEP: mcu (U.97), DRV8833 (U?#10.1)
FTRX: mcu (U.81), USBConn (U?#12.4)
FTTX: mcu (U.84), USBConn (U?#12.20)
I2C1_SCK: mcu (R?#6.1 U.78), MIKROBUS (H?#2.4)
I2C1_SDA: mcu (R?#5.1 U.94), MIKROBUS (H?#2.3)
I2C2_SCK: mcu (R?#4.1 U.69), MIKROBUS (H?#3.4)
I2C2_SDA: mcu (R?#3.1 U.70), MIKROBUS (H?#3.3)
MCS1: mcu (U.26), MIKROBUS (H?#2.11)
MCS2: mcu (U.51), MIKROBUS (H?#3.11)
MCU_WS_OUT: mcu (U.85), WS2812bDiode (R?#32.1)
MMISO1: mcu (U.28), MIKROBUS (H?#2.13)
MMISO2: mcu (U.53), MIKROBUS (H?#3.13)
MMOSI1: mcu (U.29), MIKROBUS (H?#2.14)
MMOSI2: mcu (U.54), MIKROBUS (H?#3.14)
MRX1: mcu (U.30), MIKROBUS (H?#2.6)
MRX2: mcu (U.22), MIKROBUS (H?#3.6)
MSCK1: mcu (U.27), MIKROBUS (H?#2.12)
MSCK2: mcu (U.52), MIKROBUS (H?#3.12)
MTX1: mcu (U.31), MIKROBUS (H?#2.5)
MTX2: mcu (U.25), MIKROBUS (H?#3.5)
OUTA_L: mcu (U.11), DRV8833 (U?#11.3)
PG10-NRST: mcu (C?#13.1 SW?#1.2 U.14), SWD (H?#1.10)
RPI_UART0_Rx: mcu (U.55), RPIPICOW (U?#8.22)
RPI_UART0_Tx: mcu (U.56), RPIPICOW (U?#8.21)
SWCLK: mcu (U.77), SWD (H?#1.4)
SWDIO: mcu (U.76), SWD (H?#1.2)